# EAGLE schematic esp-tree (EAGLE 8.4.3)
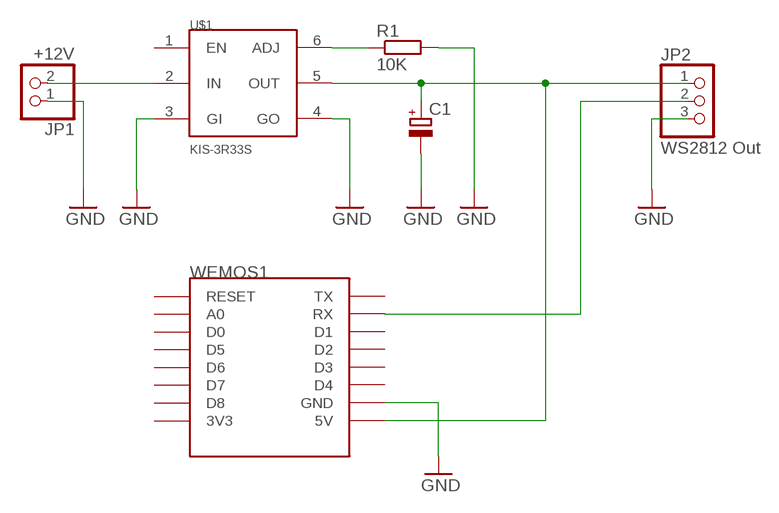
[diagram p0: schematic, sheet 1]

## Parts
C1  CPOL-EUB45181B  [B45181B]
JP1  +12V  PINHD-1X2  [1X02]
JP2  WS2812 Out  PINHD-1X3  [1X03]
R1  10K  R-EU_0204/5  [0204/5]
U$1  KIS-3R33S  [KIS-3R33S]
WEMOS1  WEMOS-D1-MINI  [WEMOS-D1-MINI]

## Nets
GND: C1.- JP1.1 JP2.3 R1.2 U$1.3(GI) U$1.4(GO) WEMOS1.GND
N$1: R1.1 U$1.6(ADJ)
N$2: C1.+ JP2.1 U$1.5(OUT) WEMOS1.5V
N$3: JP1.2 U$1.2(IN)
N$4: JP2.2 WEMOS1.RX
Unconnected: U$1.1(EN) WEMOS1.3V3 WEMOS1.A0 WEMOS1.D0 WEMOS1.D1 WEMOS1.D2 WEMOS1.D3 WEMOS1.D4 WEMOS1.D5 WEMOS1.D6 WEMOS1.D7 WEMOS1.D8 WEMOS1.RESET WEMOS1.TX

## Library data of the parts
C1 = rcl:CPOL-EU: POLARIZED CAPACITOR, European symbol
JP1 = pinhead:PINHD-1X2: PIN HEADER
JP2 = pinhead:PINHD-1X3: PIN HEADER
R1 = resistor:R-EU_: RESISTOR, European symbol
U$1 = KIS-3R33S:KIS-3R33S: DC-DC Converter
WEMOS1 = esp8266modules:WEMOS-D1-MINI: WeMos.cc D1 mini ESP8266 module